# Altium schematic sheet POWR0010_BCR_TESTBOARD.SchDoc: Battery charge regulator prototype board
size A3; Author: T. FISK; Engineer: Thomas Fisk; Organization: BLUEsat Project; Address1: Room 419; Address2: School of EE&T; Address3: UNSW, NSW 2052; Address4: Australia; DocumentNumber: POWR0010; SheetNumber: 1; SheetTotal: 1; Description: FLATSAT prototype PCB of BCR subsystem; Version: 1.0; PageSetup: Record=PageOptions|CenterHorizontal=True|CenterVertical=True|PrintScale=0.71|XCorrection=1.00|YCorrection=1.00|PrintKind=1|BorderSize=5000000|LeftOffset=0|BottomOffset=0|Orientation=2|PaperLength=1000|PaperWidth=1000|Scale=100|PaperSource=7|PrintQuality=1200|MediaType=1|DitherType=10|PaperKind=A4|PrintScaleMode=1
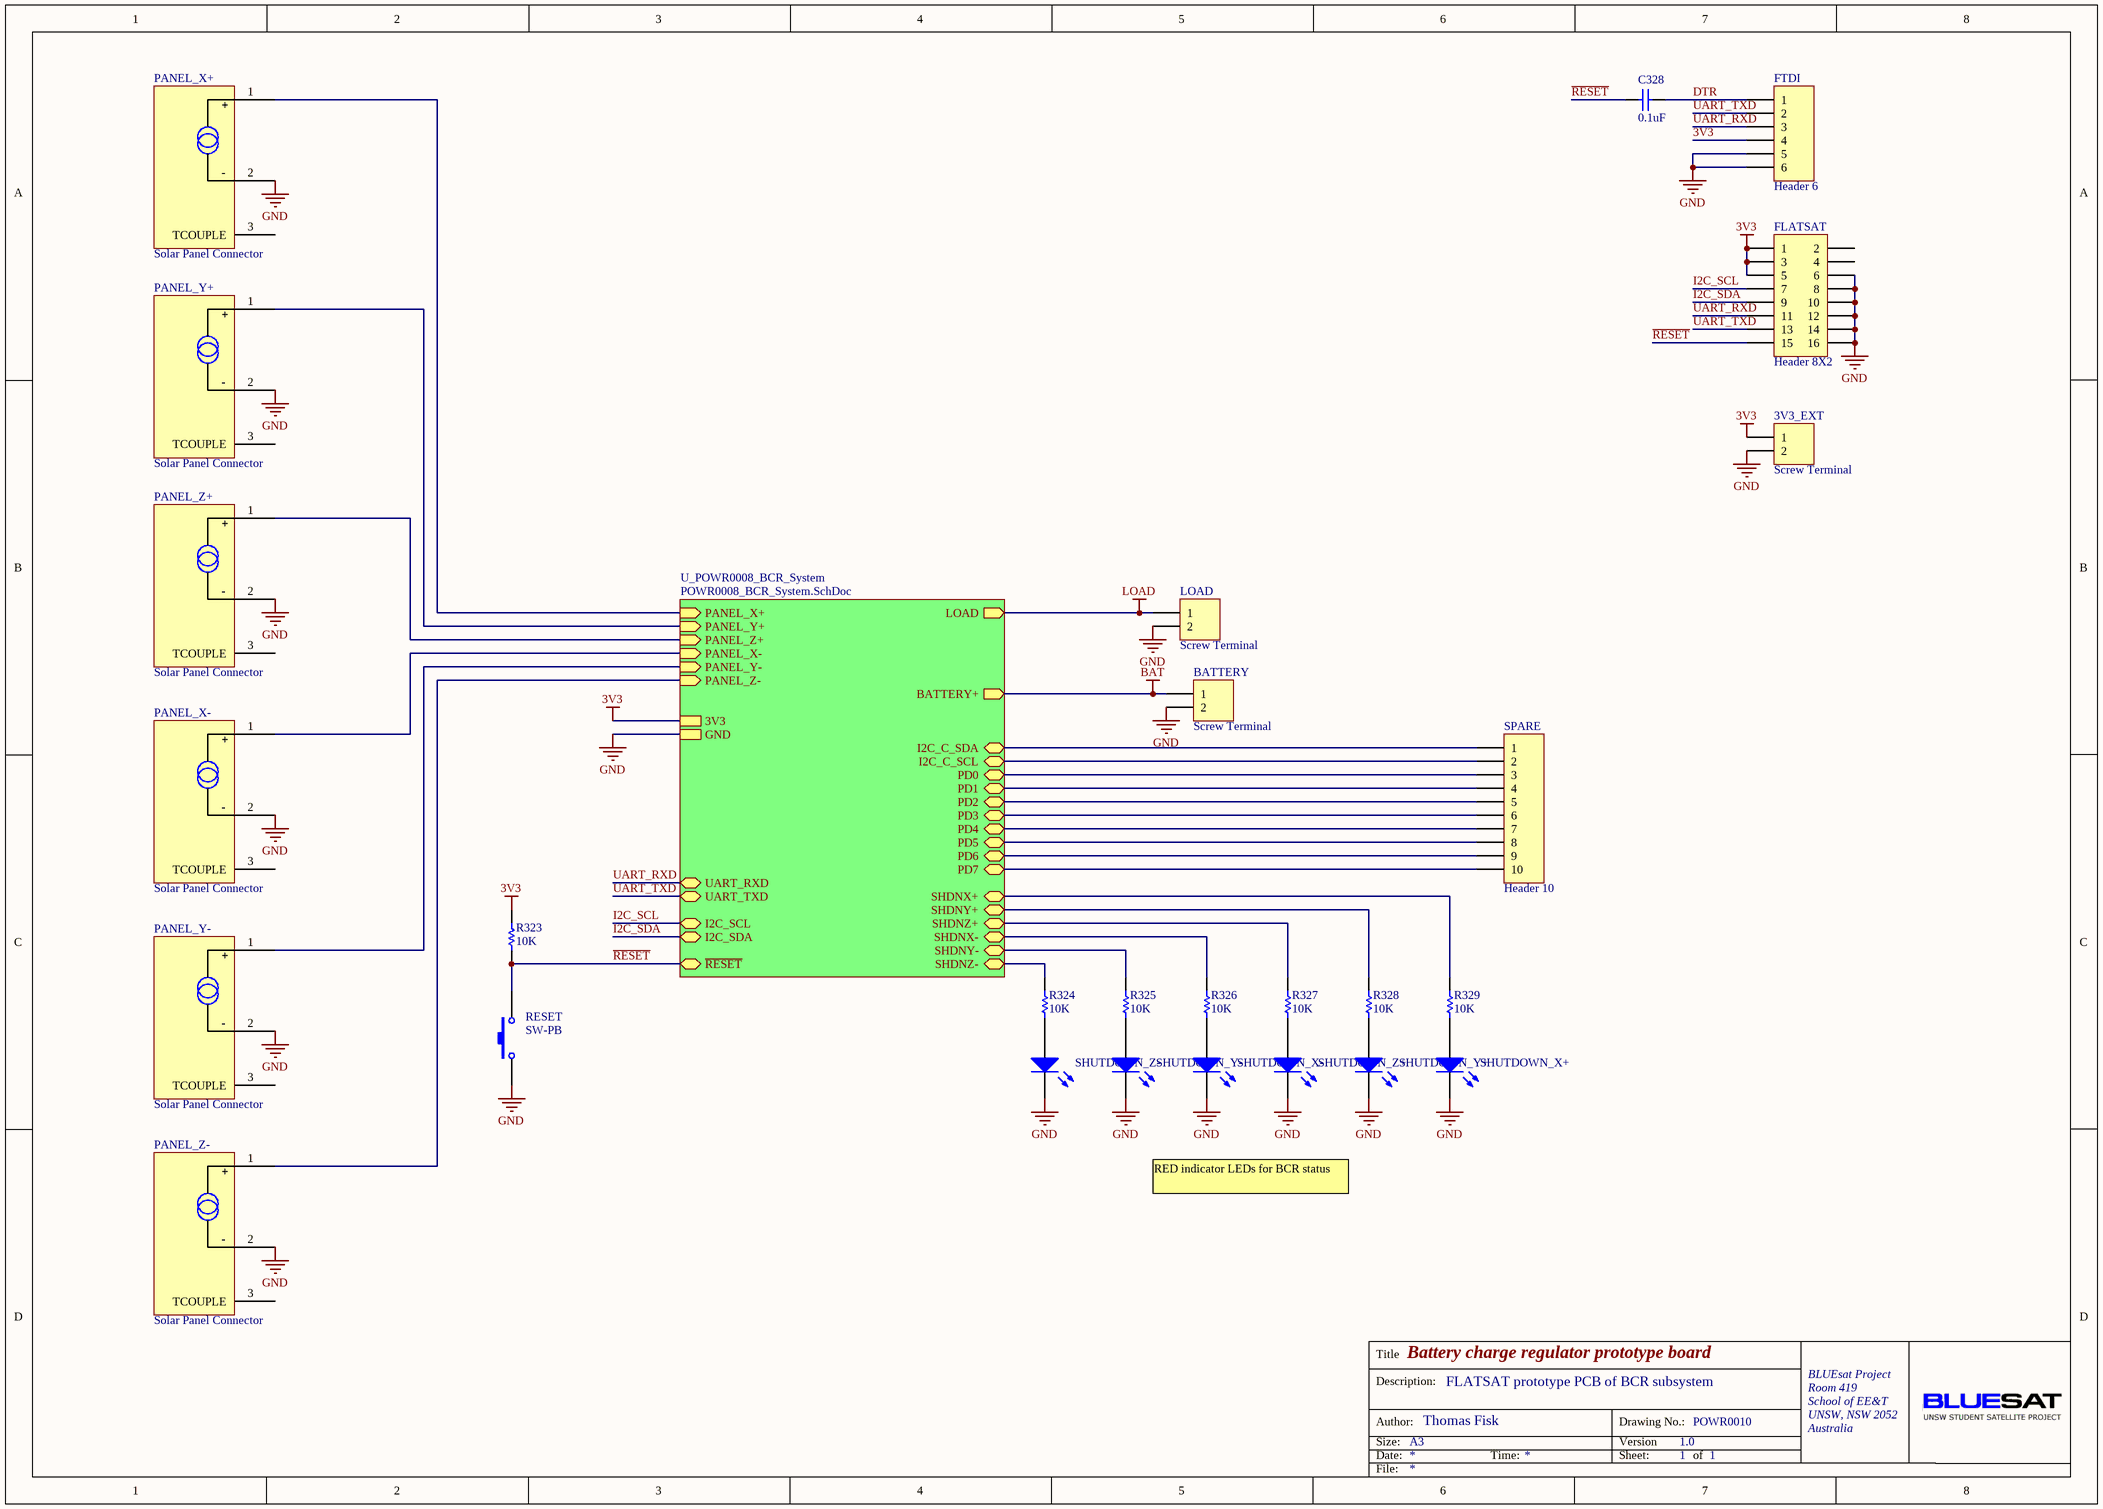
[diagram p0: POWR0010_BCR_TESTBOARD.SchDoc]

## Parts
3V3_EXT  Screw Terminal  [SCREW2]
BATTERY  Screw Terminal  [SCREW2]
C328  value 0.1uF  [CAPC2012M]  (hidden comment: Cap)
FLATSAT  Header 8X2  [HDR2X8]
FTDI  Header 6  [HDR1X6]
LOAD  Screw Terminal  [SCREW2]
PANEL_X+  Solar Panel Connector  [SCREW2]
PANEL_X-  Solar Panel Connector  [SCREW2]
PANEL_Y+  Solar Panel Connector  [SCREW2]
PANEL_Y-  Solar Panel Connector  [SCREW2]
PANEL_Z+  Solar Panel Connector  [SCREW2]
PANEL_Z-  Solar Panel Connector  [SCREW2]
R323  value 10K  [RESC2012M]  (hidden comment: Res1)
R324  value 10K  [RESC2012M]  (hidden comment: Res1)
R325  value 10K  [RESC2012M]  (hidden comment: Res1)
R326  value 10K  [RESC2012M]  (hidden comment: Res1)
R327  value 10K  [RESC2012M]  (hidden comment: Res1)
R328  value 10K  [RESC2012M]  (hidden comment: Res1)
R329  value 10K  [RESC2012M]  (hidden comment: Res1)
RESET  SW-PB  [RESET SWITCH]
SHUTDOWN_X+  8V0_RX2  [6-0805_M]  (value not drawn)
SHUTDOWN_X-  VVAR_TX1  [6-0805_M]  (value not drawn)
SHUTDOWN_Y+  VVAR_TX1  [6-0805_M]  (value not drawn)
SHUTDOWN_Y-  8V0_RX2  [6-0805_M]  (value not drawn)
SHUTDOWN_Z+  8V0_RX2  [6-0805_M]  (value not drawn)
SHUTDOWN_Z-  VVAR_TX1  [6-0805_M]  (value not drawn)
SPARE  Header 10  [HDR1X10]

## Sub-sheets
U_POWR0008_BCR_System = POWR0008_BCR_System.SchDoc: PANEL_X+ (in), PANEL_Y+ (in), PANEL_Z+ (in), PANEL_X- (in), PANEL_Y- (in), PANEL_Z- (in), UART_RXD (bidir), UART_TXD (bidir), LOAD (out), BATTERY+ (out), 3V3, GND, SHDNX+ (bidir), SHDNY+ (bidir), SHDNZ+ (bidir), SHDNX- (bidir), SHDNY- (bidir), SHDNZ- (bidir), I2C_SCL (bidir), I2C_SDA (bidir), ~{RESET} (bidir), PD0 (bidir), PD1 (bidir), PD2 (bidir), PD3 (bidir), PD4 (bidir), PD5 (bidir), PD6 (bidir), PD7 (bidir), I2C_C_SDA (bidir), I2C_C_SCL (bidir)

## Nets
3V3: 3V3_EXT.1 FLATSAT.1 FLATSAT.3 FLATSAT.5 FTDI.4 R323.1 ; sheet U_POWR0008_BCR_System/3V3
BAT: BATTERY.1 ; sheet U_POWR0008_BCR_System/BATTERY+
GND: 3V3_EXT.2 BATTERY.2 FLATSAT.6 FLATSAT.8 FLATSAT.10 FLATSAT.12 FLATSAT.14 FLATSAT.16 FTDI.5 FTDI.6 LOAD.2 PANEL_X+.2(PANEL-) PANEL_X-.2(PANEL-) PANEL_Y+.2(PANEL-) PANEL_Y-.2(PANEL-) PANEL_Z+.2(PANEL-) PANEL_Z-.2(PANEL-) RESET.1 SHUTDOWN_X+.2(K) SHUTDOWN_X-.2(K) SHUTDOWN_Y+.2(K) SHUTDOWN_Y-.2(K) SHUTDOWN_Z+.2(K) SHUTDOWN_Z-.2(K) ; sheet U_POWR0008_BCR_System/GND
LOAD: LOAD.1 ; sheet U_POWR0008_BCR_System/LOAD
DTR: C328.1 FTDI.1
I2C_SCL: FLATSAT.7 ; sheet U_POWR0008_BCR_System/I2C_SCL
I2C_SDA: FLATSAT.9 ; sheet U_POWR0008_BCR_System/I2C_SDA
~{RESET}: C328.2 FLATSAT.15 R323.2 RESET.2 ; sheet U_POWR0008_BCR_System/~{RESET}
UART_RXD: FLATSAT.11 FTDI.3 ; sheet U_POWR0008_BCR_System/UART_RXD
UART_TXD: FLATSAT.13 FTDI.2 ; sheet U_POWR0008_BCR_System/UART_TXD
NetPANEL_X+_1: PANEL_X+.1(PANEL+) ; sheet U_POWR0008_BCR_System/PANEL_X+
NetPANEL_X-_1: PANEL_X-.1(PANEL+) ; sheet U_POWR0008_BCR_System/PANEL_X-
NetPANEL_Y+_1: PANEL_Y+.1(PANEL+) ; sheet U_POWR0008_BCR_System/PANEL_Y+
NetPANEL_Y-_1: PANEL_Y-.1(PANEL+) ; sheet U_POWR0008_BCR_System/PANEL_Y-
NetPANEL_Z+_1: PANEL_Z+.1(PANEL+) ; sheet U_POWR0008_BCR_System/PANEL_Z+
NetPANEL_Z-_1: PANEL_Z-.1(PANEL+) ; sheet U_POWR0008_BCR_System/PANEL_Z-
NetR324_1: R324.1 SHUTDOWN_Z-.1(A)
NetR324_2: R324.2 ; sheet U_POWR0008_BCR_System/SHDNZ-
NetR325_1: R325.1 SHUTDOWN_Y-.1(A)
NetR325_2: R325.2 ; sheet U_POWR0008_BCR_System/SHDNY-
NetR326_1: R326.1 SHUTDOWN_X-.1(A)
NetR326_2: R326.2 ; sheet U_POWR0008_BCR_System/SHDNX-
NetR327_1: R327.1 SHUTDOWN_Z+.1(A)
NetR327_2: R327.2 ; sheet U_POWR0008_BCR_System/SHDNZ+
NetR328_1: R328.1 SHUTDOWN_Y+.1(A)
NetR328_2: R328.2 ; sheet U_POWR0008_BCR_System/SHDNY+
NetR329_1: R329.1 SHUTDOWN_X+.1(A)
NetR329_2: R329.2 ; sheet U_POWR0008_BCR_System/SHDNX+
NetSPARE_1: SPARE.1 ; sheet U_POWR0008_BCR_System/I2C_C_SDA
NetSPARE_2: SPARE.2 ; sheet U_POWR0008_BCR_System/I2C_C_SCL
NetSPARE_3: SPARE.3 ; sheet U_POWR0008_BCR_System/PD0
NetSPARE_4: SPARE.4 ; sheet U_POWR0008_BCR_System/PD1
NetSPARE_5: SPARE.5 ; sheet U_POWR0008_BCR_System/PD2
NetSPARE_6: SPARE.6 ; sheet U_POWR0008_BCR_System/PD3
NetSPARE_7: SPARE.7 ; sheet U_POWR0008_BCR_System/PD4
NetSPARE_8: SPARE.8 ; sheet U_POWR0008_BCR_System/PD5
NetSPARE_9: SPARE.9 ; sheet U_POWR0008_BCR_System/PD6
NetSPARE_10: SPARE.10 ; sheet U_POWR0008_BCR_System/PD7

Not connected (* = marked no-connect by the designer): FLATSAT 2 4; PANEL_X+ 3(TCOUPLE); PANEL_X- 3(TCOUPLE); PANEL_Y+ 3(TCOUPLE); PANEL_Y- 3(TCOUPLE); PANEL_Z+ 3(TCOUPLE); PANEL_Z- 3(TCOUPLE)

## Notes on the sheet
- RED indicator LEDs for BCR status
- Title
- Description:
- Size:
- Author:
- Date:
- A3
- Time:
- Version
- Sheet:
- Drawing No.:
- of
- File:
- (in symbol Solar Panel Connector) +; -

## Library data of the parts
3V3_EXT BATTERY LOAD = Header 2: Header, 2-Pin; LatestRevisionDate: 17-Jul-2002; LatestRevisionNote: Re-released for DXP Platform.; Publisher: Altium Limited
C328 = Cap: Capacitor; Published: 8-Jun-2000; LatestRevisionDate: 17-Jul-2002; LatestRevisionNote: Re-released for DXP Platform.; PackageReference: RAD-0.3; Publisher: Altium Limited; PackageDescription: Radial Cap, Thru-Hole; 2 Leads; 0.3 in Pin Spacing; Supplier 1: Farnell; Supplier 2: Farnell; Supplier Part Number 2: 1759265
FLATSAT = Header 8X2: Header, 8-Pin, Dual row; LatestRevisionDate: 17-Jul-2002; LatestRevisionNote: Re-released for DXP Platform.; Publisher: Altium Limited
FTDI = Header 6: Header, 6-Pin; LatestRevisionDate: 17-Jul-2002; LatestRevisionNote: Re-released for DXP Platform.; Publisher: Altium Limited
R323-R329 = Res1: Resistor; Published: 8-Jun-2000; LatestRevisionDate: 17-Jul-2002; LatestRevisionNote: Re-released for DXP Platform.; PackageReference: AXIAL-0.3; Publisher: Altium Limited; PackageDescription: Axial Device, Thru-Hole; 2 Leads; 0.3 in Pin Spacing; Supplier 1: Farnell
RESET = SW-PB: Switch; Published: 24-Mar-1999; LatestRevisionDate: 17-Jul-2002; LatestRevisionNote: Re-released for DXP Platform.; PackageReference: SPST-2; Publisher: Altium Limited; PackageDescription: Switch; 2 Leads
SHUTDOWN_X+ SHUTDOWN_X- SHUTDOWN_Y+ SHUTDOWN_Y- SHUTDOWN_Z+ SHUTDOWN_Z- = LED0: Typical INFRARED GaAs LED; Published: 8-Jun-2000; LatestRevisionDate: 08-Jul-2005; LatestRevisionNote: Mech Layer 1 removed.; PackageReference: LED-0; Publisher: Altium Limited; PackageDescription: LED; 2 Leads; ClassName: LED_BANK_PWR
SPARE = Header 10: Header, 10-Pin; LatestRevisionDate: 17-Jul-2002; LatestRevisionNote: Re-released for DXP Platform.; Publisher: Altium Limited